# EAGLE schematic module_core_4 (EAGLE 5.10)
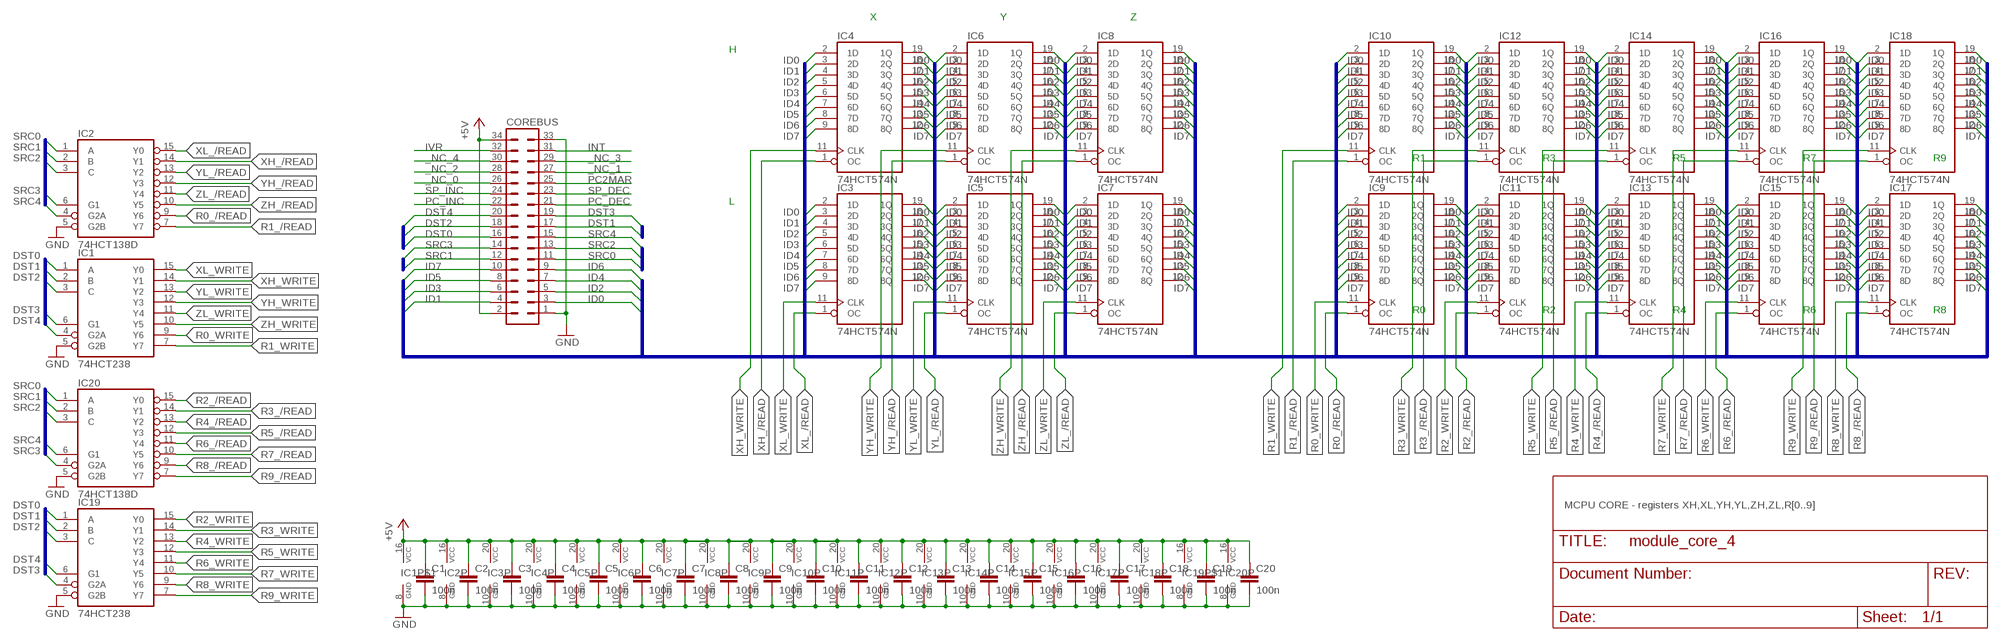
[diagram p0: schematic, sheet 1]

## Parts
C1  100n  C-EUC1206  [C1206]
C2  100n  C-EUC1206  [C1206]
C3  100n  C-EUC1206  [C1206]
C4  100n  C-EUC1206  [C1206]
C5  100n  C-EUC1206  [C1206]
C6  100n  C-EUC1206  [C1206]
C7  100n  C-EUC1206  [C1206]
C8  100n  C-EUC1206  [C1206]
C9  100n  C-EUC1206  [C1206]
C10  100n  C-EUC1206  [C1206]
C11  100n  C-EUC1206  [C1206]
C12  100n  C-EUC1206  [C1206]
C13  100n  C-EUC1206  [C1206]
C14  100n  C-EUC1206  [C1206]
C15  100n  C-EUC1206  [C1206]
C16  100n  C-EUC1206  [C1206]
C17  100n  C-EUC1206  [C1206]
C18  100n  C-EUC1206  [C1206]
C19  100n  C-EUC1206  [C1206]
C20  100n  C-EUC1206  [C1206]
COREBUS  ML34L  [ML34L]
IC1  74HCT238  74238SO16  [SO16]
IC2  74HCT138D  [SO16]
IC3  74HCT574N  [DIL20]
IC4  74HCT574N  [DIL20]
IC5  74HCT574N  [DIL20]
IC6  74HCT574N  [DIL20]
IC7  74HCT574N  [DIL20]
IC8  74HCT574N  [DIL20]
IC9  74HCT574N  [DIL20]
IC10  74HCT574N  [DIL20]
IC11  74HCT574N  [DIL20]
IC12  74HCT574N  [DIL20]
IC13  74HCT574N  [DIL20]
IC14  74HCT574N  [DIL20]
IC15  74HCT574N  [DIL20]
IC16  74HCT574N  [DIL20]
IC17  74HCT574N  [DIL20]
IC18  74HCT574N  [DIL20]
IC19  74HCT238  74238SO16  [SO16]
IC20  74HCT138D  [SO16]

## Nets
+5V: C1.1 C2.1 C3.1 C4.1 C5.1 C6.1 C7.1 C8.1 C9.1 C10.1 C11.1 C12.1 C13.1 C14.1 C15.1 C16.1 C17.1 C18.1 C19.1 C20.1 COREBUS.2 COREBUS.34 IC1.16(VCC) IC2.16(VCC) IC3.20(VCC) IC4.20(VCC) IC5.20(VCC) IC6.20(VCC) IC7.20(VCC) IC8.20(VCC) IC9.20(VCC) IC10.20(VCC) IC11.20(VCC) IC12.20(VCC) IC13.20(VCC) IC14.20(VCC) IC15.20(VCC) IC16.20(VCC) IC17.20(VCC) IC18.20(VCC) IC19.16(VCC) IC20.16(VCC)
_NC_0: COREBUS.26
_NC_1: COREBUS.27
_NC_2: COREBUS.28
_NC_3: COREBUS.29
_NC_4: COREBUS.30
DST0: COREBUS.16 IC1.1(A) IC19.1(A)
DST1: COREBUS.17 IC1.2(B) IC19.2(B)
DST2: COREBUS.18 IC1.3(C) IC19.3(C)
DST3: COREBUS.19 IC1.6(G1) IC19.4(G2A)
DST4: COREBUS.20 IC1.4(G2A) IC19.6(G1)
GND: C1.2 C2.2 C3.2 C4.2 C5.2 C6.2 C7.2 C8.2 C9.2 C10.2 C11.2 C12.2 C13.2 C14.2 C15.2 C16.2 C17.2 C18.2 C19.2 C20.2 COREBUS.1 COREBUS.33 IC1.5(G2B) IC1.8(GND) IC2.5(G2B) IC2.8(GND) IC3.10(GND) IC4.10(GND) IC5.10(GND) IC6.10(GND) IC7.10(GND) IC8.10(GND) IC9.10(GND) IC10.10(GND) IC11.10(GND) IC12.10(GND) IC13.10(GND) IC14.10(GND) IC15.10(GND) IC16.10(GND) IC17.10(GND) IC18.10(GND) IC19.5(G2B) IC19.8(GND) IC20.5(G2B) IC20.8(GND)
ID0: COREBUS.3 IC3.2(1D) IC3.19(1Q) IC4.2(1D) IC4.19(1Q) IC5.2(1D) IC5.19(1Q) IC6.2(1D) IC6.19(1Q) IC7.2(1D) IC7.19(1Q) IC8.2(1D) IC8.19(1Q) IC9.2(1D) IC9.19(1Q) IC10.2(1D) IC10.19(1Q) IC11.2(1D) IC11.19(1Q) IC12.2(1D) IC12.19(1Q) IC13.2(1D) IC13.19(1Q) IC14.2(1D) IC14.19(1Q) IC15.2(1D) IC15.19(1Q) IC16.2(1D) IC16.19(1Q) IC17.2(1D) IC17.19(1Q) IC18.2(1D) IC18.19(1Q)
ID1: COREBUS.4 IC3.3(2D) IC3.18(2Q) IC4.3(2D) IC4.18(2Q) IC5.3(2D) IC5.18(2Q) IC6.3(2D) IC6.18(2Q) IC7.3(2D) IC7.18(2Q) IC8.3(2D) IC8.18(2Q) IC9.3(2D) IC9.18(2Q) IC10.3(2D) IC10.18(2Q) IC11.3(2D) IC11.18(2Q) IC12.3(2D) IC12.18(2Q) IC13.3(2D) IC13.18(2Q) IC14.3(2D) IC14.18(2Q) IC15.3(2D) IC15.18(2Q) IC16.3(2D) IC16.18(2Q) IC17.3(2D) IC17.18(2Q) IC18.3(2D) IC18.18(2Q)
ID2: COREBUS.5 IC3.4(3D) IC3.17(3Q) IC4.4(3D) IC4.17(3Q) IC5.4(3D) IC5.17(3Q) IC6.4(3D) IC6.17(3Q) IC7.4(3D) IC7.17(3Q) IC8.4(3D) IC8.17(3Q) IC9.4(3D) IC9.17(3Q) IC10.4(3D) IC10.17(3Q) IC11.4(3D) IC11.17(3Q) IC12.4(3D) IC12.17(3Q) IC13.4(3D) IC13.17(3Q) IC14.4(3D) IC14.17(3Q) IC15.4(3D) IC15.17(3Q) IC16.4(3D) IC16.17(3Q) IC17.4(3D) IC17.17(3Q) IC18.4(3D) IC18.17(3Q)
ID3: COREBUS.6 IC3.5(4D) IC3.16(4Q) IC4.5(4D) IC4.16(4Q) IC5.5(4D) IC5.16(4Q) IC6.5(4D) IC6.16(4Q) IC7.5(4D) IC7.16(4Q) IC8.5(4D) IC8.16(4Q) IC9.5(4D) IC9.16(4Q) IC10.5(4D) IC10.16(4Q) IC11.5(4D) IC11.16(4Q) IC12.5(4D) IC12.16(4Q) IC13.5(4D) IC13.16(4Q) IC14.5(4D) IC14.16(4Q) IC15.5(4D) IC15.16(4Q) IC16.5(4D) IC16.16(4Q) IC17.5(4D) IC17.16(4Q) IC18.5(4D) IC18.16(4Q)
ID4: COREBUS.7 IC3.6(5D) IC3.15(5Q) IC4.6(5D) IC4.15(5Q) IC5.6(5D) IC5.15(5Q) IC6.6(5D) IC6.15(5Q) IC7.6(5D) IC7.15(5Q) IC8.6(5D) IC8.15(5Q) IC9.6(5D) IC9.15(5Q) IC10.6(5D) IC10.15(5Q) IC11.6(5D) IC11.15(5Q) IC12.6(5D) IC12.15(5Q) IC13.6(5D) IC13.15(5Q) IC14.6(5D) IC14.15(5Q) IC15.6(5D) IC15.15(5Q) IC16.6(5D) IC16.15(5Q) IC17.6(5D) IC17.15(5Q) IC18.6(5D) IC18.15(5Q)
ID5: COREBUS.8 IC3.7(6D) IC3.14(6Q) IC4.7(6D) IC4.14(6Q) IC5.7(6D) IC5.14(6Q) IC6.7(6D) IC6.14(6Q) IC7.7(6D) IC7.14(6Q) IC8.7(6D) IC8.14(6Q) IC9.7(6D) IC9.14(6Q) IC10.7(6D) IC10.14(6Q) IC11.7(6D) IC11.14(6Q) IC12.7(6D) IC12.14(6Q) IC13.7(6D) IC13.14(6Q) IC14.7(6D) IC14.14(6Q) IC15.7(6D) IC15.14(6Q) IC16.7(6D) IC16.14(6Q) IC17.7(6D) IC17.14(6Q) IC18.7(6D) IC18.14(6Q)
ID6: COREBUS.9 IC3.8(7D) IC3.13(7Q) IC4.8(7D) IC4.13(7Q) IC5.8(7D) IC5.13(7Q) IC6.8(7D) IC6.13(7Q) IC7.8(7D) IC7.13(7Q) IC8.8(7D) IC8.13(7Q) IC9.8(7D) IC9.13(7Q) IC10.8(7D) IC10.13(7Q) IC11.8(7D) IC11.13(7Q) IC12.8(7D) IC12.13(7Q) IC13.8(7D) IC13.13(7Q) IC14.8(7D) IC14.13(7Q) IC15.8(7D) IC15.13(7Q) IC16.8(7D) IC16.13(7Q) IC17.8(7D) IC17.13(7Q) IC18.8(7D) IC18.13(7Q)
ID7: COREBUS.10 IC3.9(8D) IC3.12(8Q) IC4.9(8D) IC4.12(8Q) IC5.9(8D) IC5.12(8Q) IC6.9(8D) IC6.12(8Q) IC7.9(8D) IC7.12(8Q) IC8.9(8D) IC8.12(8Q) IC9.9(8D) IC9.12(8Q) IC10.9(8D) IC10.12(8Q) IC11.9(8D) IC11.12(8Q) IC12.9(8D) IC12.12(8Q) IC13.9(8D) IC13.12(8Q) IC14.9(8D) IC14.12(8Q) IC15.9(8D) IC15.12(8Q) IC16.9(8D) IC16.12(8Q) IC17.9(8D) IC17.12(8Q) IC18.9(8D) IC18.12(8Q)
INT: COREBUS.31
IVR: COREBUS.32
PC2MAR: COREBUS.25
PC_DEC: COREBUS.21
PC_INC: COREBUS.22
R0_/READ: IC2.9(Y6) IC9.1(OC)
R0_WRITE: IC1.9(Y6) IC9.11(CLK)
R1_/READ: IC2.7(Y7) IC10.1(OC)
R1_WRITE: IC1.7(Y7) IC10.11(CLK)
R2_/READ: IC11.1(OC) IC20.15(Y0)
R2_WRITE: IC11.11(CLK) IC19.15(Y0)
R3_/READ: IC12.1(OC) IC20.14(Y1)
R3_WRITE: IC12.11(CLK) IC19.14(Y1)
R4_/READ: IC13.1(OC) IC20.13(Y2)
R4_WRITE: IC13.11(CLK) IC19.13(Y2)
R5_/READ: IC14.1(OC) IC20.12(Y3)
R5_WRITE: IC14.11(CLK) IC19.12(Y3)
R6_/READ: IC15.1(OC) IC20.11(Y4)
R6_WRITE: IC15.11(CLK) IC19.11(Y4)
R7_/READ: IC16.1(OC) IC20.10(Y5)
R7_WRITE: IC16.11(CLK) IC19.10(Y5)
R8_/READ: IC17.1(OC) IC20.9(Y6)
R8_WRITE: IC17.11(CLK) IC19.9(Y6)
R9_/READ: IC18.1(OC) IC20.7(Y7)
R9_WRITE: IC18.11(CLK) IC19.7(Y7)
SP_DEC: COREBUS.23
SP_INC: COREBUS.24
SRC0: COREBUS.11 IC2.1(A) IC20.1(A)
SRC1: COREBUS.12 IC2.2(B) IC20.2(B)
SRC2: COREBUS.13 IC2.3(C) IC20.3(C)
SRC3: COREBUS.14 IC2.6(G1) IC20.4(G2A)
SRC4: COREBUS.15 IC2.4(G2A) IC20.6(G1)
XH_/READ: IC2.14(Y1) IC4.1(OC)
XH_WRITE: IC1.14(Y1) IC4.11(CLK)
XL_/READ: IC2.15(Y0) IC3.1(OC)
XL_WRITE: IC1.15(Y0) IC3.11(CLK)
YH_/READ: IC2.12(Y3) IC6.1(OC)
YH_WRITE: IC1.12(Y3) IC6.11(CLK)
YL_/READ: IC2.13(Y2) IC5.1(OC)
YL_WRITE: IC1.13(Y2) IC5.11(CLK)
ZH_/READ: IC2.10(Y5) IC8.1(OC)
ZH_WRITE: IC1.10(Y5) IC8.11(CLK)
ZL_/READ: IC2.11(Y4) IC7.1(OC)
ZL_WRITE: IC1.11(Y4) IC7.11(CLK)

## Buses
ID[0..7]
DST[0..4]
SRC[0..4]

## Notes on the sheet
- X | Y | Z
- H
- R1 | R3 | R5 | R7 | R9
- L
- R0 | R2 | R4 | R6 | R8
- MCPU CORE - registers XH,XL,YH,YL,ZH,ZL,R[0..9]

## Library data of the parts
C1-C20 = rcl:C-EU: CAPACITOR, European symbol
COREBUS = mcpu:ML34L: HARTING
IC1 IC19 = mcpu:74*238: 3 TO 8 LINE DECODER (DEMULTIPLEXER)
IC2 IC20 = 74xx-eu:74*138: 3-line to 8-line DECODER/DEMULTIPLEXER
IC3-IC18 = 74xx-eu:74*574: 8-bit D type FLIP FLOP bus driver

## Net classes
0 Signal: width 0.254 mm, drill 0.508 mm, clearance 0.203 mm
1 LoVolt42: width 0.61 mm, drill 0.508 mm, clearance 0.813 mm to class 0, clearance 0.305 mm
2 MedVolt100: width 0.61 mm, drill 0.508 mm, clearance 1.626 mm to class 0, clearance 1.626 mm to class 1, clearance 0.813 mm
3 LineVolt350: width 0.813 mm, drill 0.508 mm, clearance 12.7 mm to class 0, clearance 12.7 mm to class 1, clearance 12.7 mm to class 2, clearance 2.54 mm